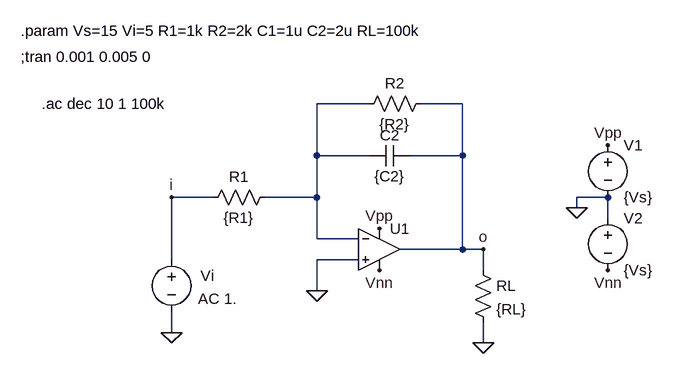
[diagram p0: schematic Filter01.asc]
Filter01.asc, the LTspice schematic file:
Version 4
SHEET 1 968 680
WIRE 144 0 64 0
WIRE 288 0 224 0
WIRE 64 80 64 0
WIRE 144 80 64 80
WIRE 288 80 288 0
WIRE 288 80 208 80
WIRE -96 144 -160 144
WIRE 64 144 64 80
WIRE 64 144 -16 144
WIRE 512 144 464 144
WIRE 464 160 464 144
WIRE 512 176 512 144
WIRE 64 208 64 144
WIRE 128 208 64 208
WIRE 288 224 288 80
WIRE 288 224 192 224
WIRE 320 224 288 224
WIRE -160 240 -160 144
WIRE 128 240 64 240
WIRE 320 256 320 224
WIRE 64 288 64 240
WIRE -160 352 -160 320
WIRE 320 368 320 336
FLAG 512 64 Vpp
FLAG 464 160 0
FLAG 512 256 Vnn
FLAG 320 368 0
FLAG -160 352 0
FLAG 160 192 Vpp
FLAG 160 256 Vnn
FLAG 64 288 0
FLAG 320 224 o
FLAG -160 144 i
SYMBOL voltage 512 48 R0
WINDOW 123 0 0 Left 0
WINDOW 39 0 0 Left 0
SYMATTR InstName V1
SYMATTR Value {Vs}
SYMBOL voltage 512 160 R0
WINDOW 123 0 0 Left 0
WINDOW 39 0 0 Left 0
SYMATTR InstName V2
SYMATTR Value {Vs}
SYMBOL res 304 240 R0
SYMATTR InstName RL
SYMATTR Value {RL}
SYMBOL voltage -160 224 R0
WINDOW 3 41 76 Left 2
WINDOW 123 0 0 Left 0
WINDOW 39 0 0 Left 0
WINDOW 0 45 41 Left 2
SYMATTR Value AC 1.
SYMATTR InstName Vi
SYMBOL Opamps\\UniversalOpamp2 160 224 R0
SYMATTR InstName U1
SYMBOL cap 208 64 R90
WINDOW 0 0 32 VBottom 2
WINDOW 3 32 32 VTop 2
SYMATTR InstName C2
SYMATTR Value {C2}
SYMBOL res 0 128 R90
WINDOW 0 0 56 VBottom 2
WINDOW 3 32 56 VTop 2
SYMATTR InstName R1
SYMATTR Value {R1}
SYMBOL res 240 -16 R90
WINDOW 0 0 56 VBottom 2
WINDOW 3 32 56 VTop 2
SYMATTR InstName R2
SYMATTR Value {R2}
TEXT -392 -112 Left 2 !.param Vs=15 Vi=5 R1=1k R2=2k C1=1u C2=2u RL=100k
TEXT -392 -72 Left 2 !;tran 0.001 0.005 0
TEXT -360 0 Left 2 !.ac dec 10 1 100k

The netlist it stands for:
* Filter01.asc
V1 Vpp 0 {Vs}
V2 0 Vnn {Vs}
RL o 0 {RL}
Vi i 0 AC 1.
XU1 0 N001 Vpp Vnn o level.2 Avol=1Meg GBW=10Meg Slew=10Meg ilimit=25m rail=0 Vos=0 phimargin=45 en=0 enk=0 in=0 ink=0 Rin=500Meg  ; pins IN+ IN- V+ V- OUT
C2 o N001 {C2}
R1 N001 i {R1}
R2 o N001 {R2}
.param Vs=15 Vi=5 R1=1k R2=2k C1=1u C2=2u RL=100k
;tran 0.001 0.005 0
.ac dec 10 1 100k
.lib UniversalOpamps2.sub
.backanno
.end